# Altium schematic sheet POWER_PMIC.SchDoc
size A3; SheetNumber: 11; SheetTotal: 20
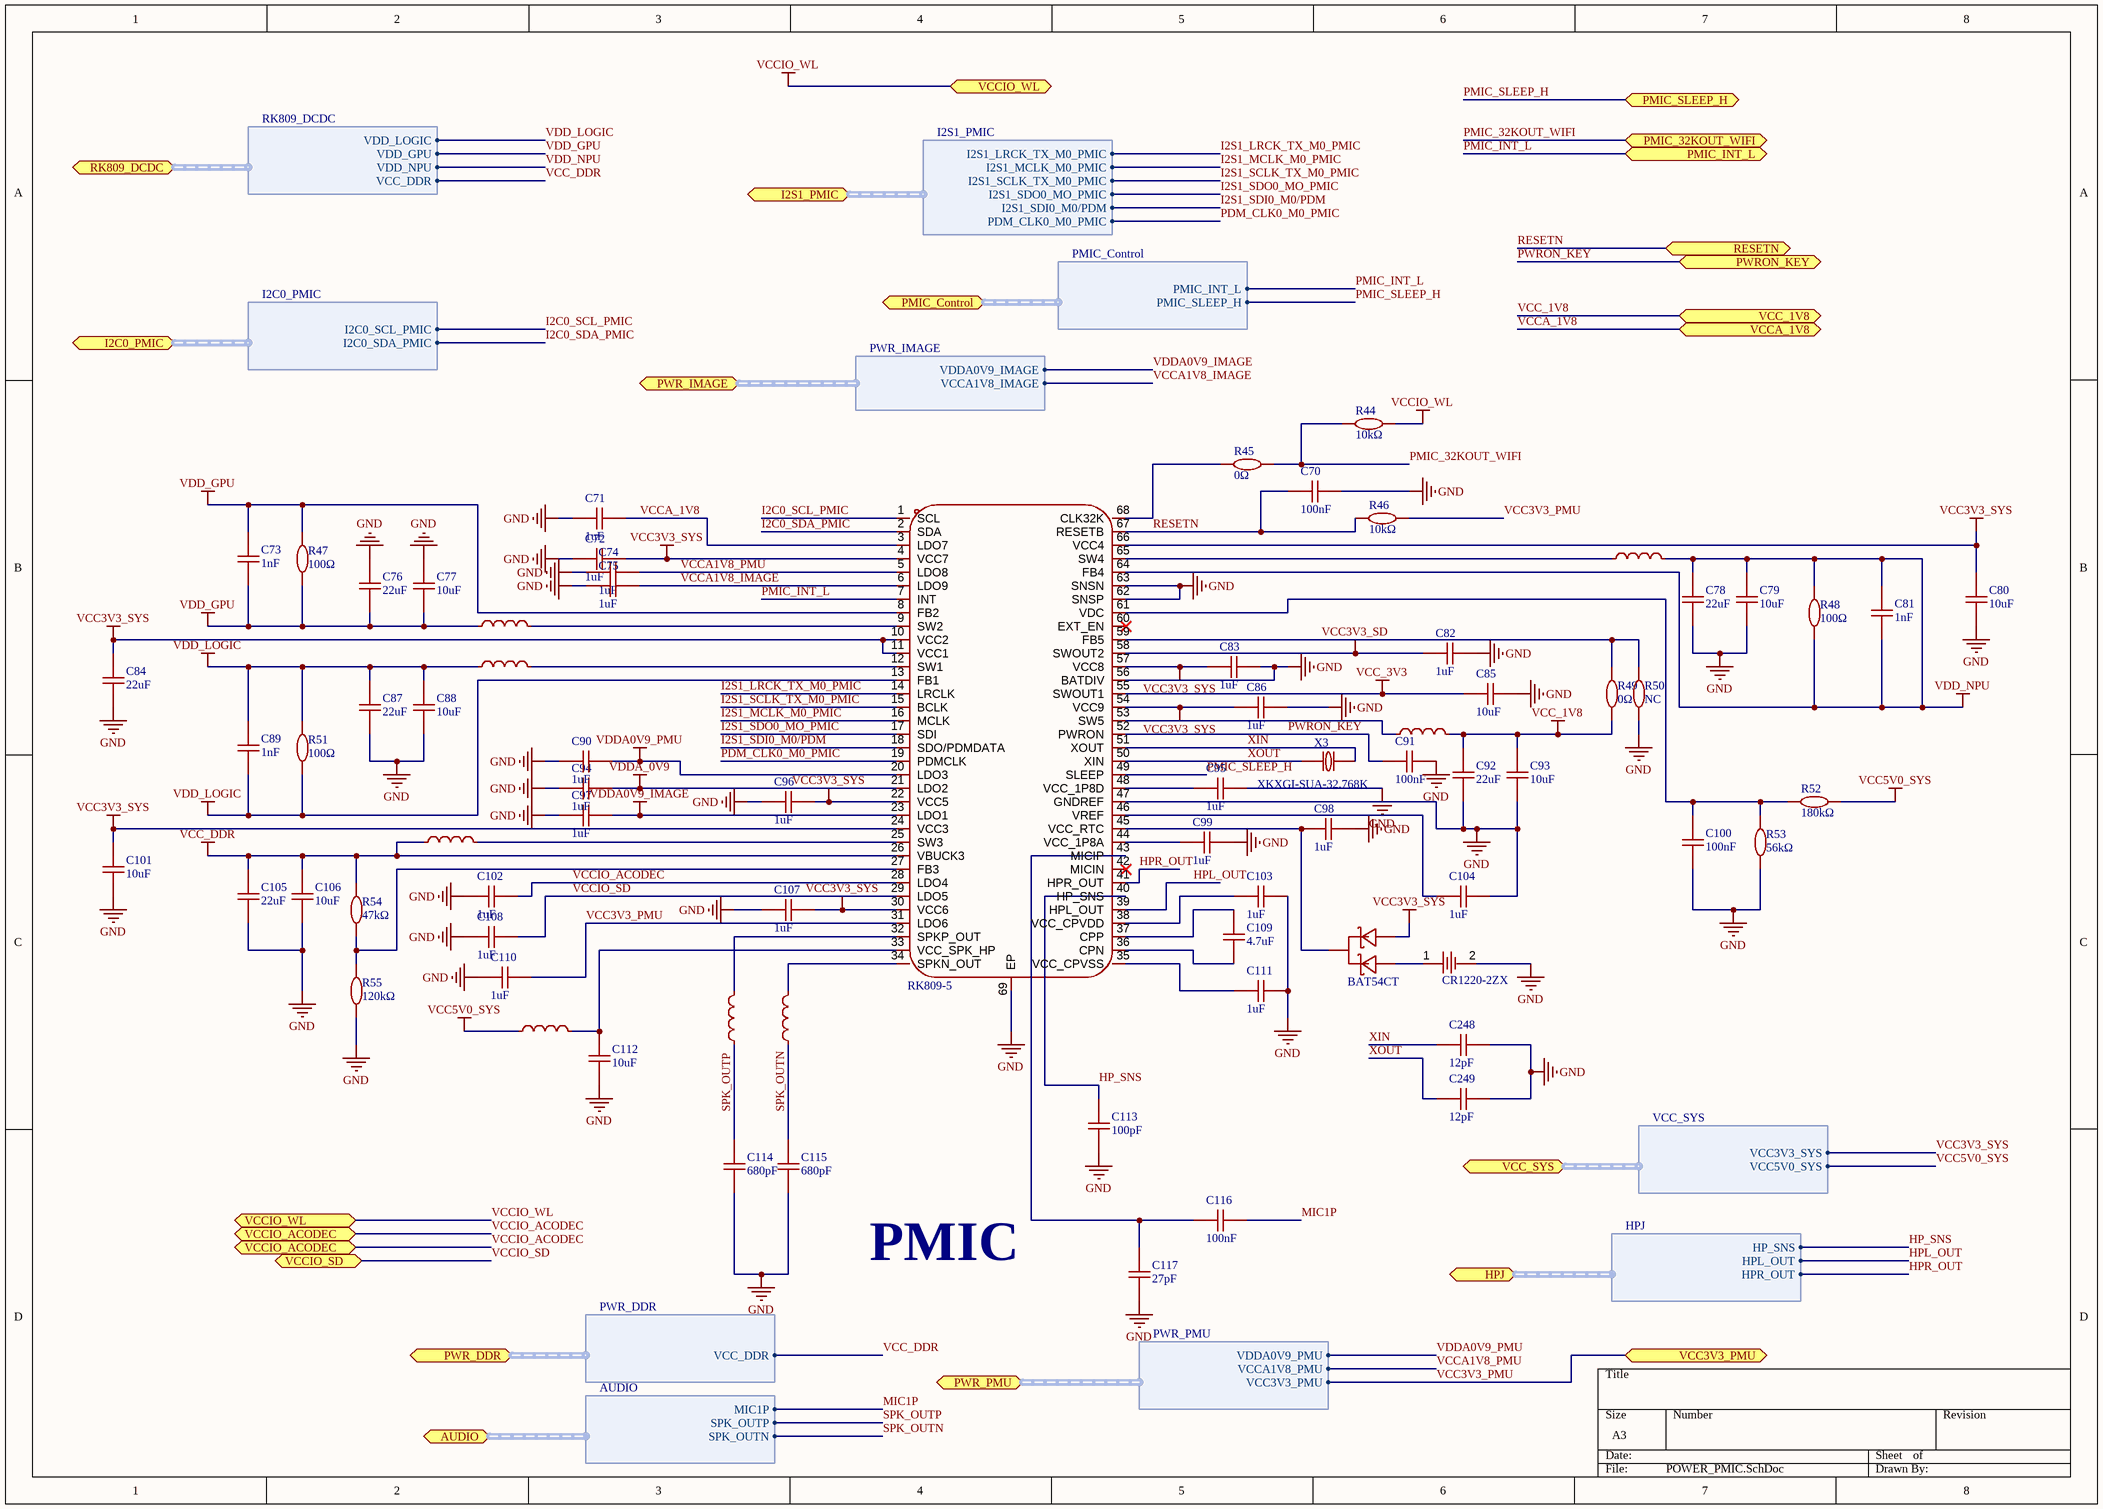
[diagram p0: POWER_PMIC.SchDoc]

## Parts
BT1  CR1220-2ZX  [BAT-SMD_CR1220-2ZX]
C70  100nF  [C0402]
C71  1uF  [C0402]
C72  1uF  [C0402]
C73  1nF  [C0402]
C74  1uF  [C0402]
C75  1uF  [C0402]
C76  22uF  [C0603]
C77  10uF  [C0603]
C78  22uF  [C0603]
C79  10uF  [C0603]
C80  10uF  [C0603]
C81  1nF  [C0402]
C82  1uF  [C0402]
C83  1uF  [C0402]
C84  22uF  [C0603]
C85  10uF  [C0603]
C86  1uF  [C0402]
C87  22uF  [C0603]
C88  10uF  [C0603]
C89  1nF  [C0402]
C90  1uF  [C0402]
C91  100nF  [C0402]
C92  22uF  [C0603]
C93  10uF  [C0603]
C94  1uF  [C0402]
C95  1uF  [C0402]
C96  1uF  [C0402]
C97  1uF  [C0402]
C98  1uF  [C0402]
C99  1uF  [C0402]
C100  100nF  [C0402]
C101  10uF  [C0603]
C102  1uF  [C0402]
C103  1uF  [C0402]
C104  1uF  [C0402]
C105  22uF  [C0603]
C106  10uF  [C0603]
C107  1uF  [C0402]
C108  1uF  [C0402]
C109  4.7uF  [C0402]
C110  1uF  [C0402]
C111  1uF  [C0402]
C112  10uF  [C0603]
C113  100pF  [C0402]
C114  680pF  [C0402]
C115  680pF  [C0402]
C116  100nF  [C0402]
C117  27pF  [C0402]
C248  12pF  [C0402]
C249  12pF  [C0402]
D9  BAT54CT  [SOT-523-3_L1.6-W0.8-P1.00-LS1.6-BR]
L3  470nH  [IND-SMD_L2.0-W1.6_MHCHL201610A-1R0M-Q8A]  (value not drawn)
L4  470nH  [IND-SMD_L2.0-W1.6_MHCHL201610A-1R0M-Q8A]  (value not drawn)
L5  470nH  [IND-SMD_L2.0-W1.6_MHCHL201610A-1R0M-Q8A]  (value not drawn)
L6  470nH  [IND-SMD_L2.0-W1.6_MHCHL201610A-1R0M-Q8A]  (value not drawn)
L7  470nH  [IND-SMD_L2.0-W1.6_MHCHL201610A-1R0M-Q8A]  (value not drawn)
L8  180Ω  [L0603]  (value not drawn)
L9  180Ω  [L0603]  (value not drawn)
L10  180Ω  [L0603]  (value not drawn)
R44  10kΩ  [R0402]
R45  0Ω  [R0402]
R46  10kΩ  [R0402]
R47  100Ω  [R0402]
R48  100Ω  [R0402]
R49  0Ω  [R0402]
R50  NC  [R0402]
R51  100Ω  [R0402]
R52  180kΩ  [R0402]
R53  56kΩ  [R0402]
R54  47kΩ  [R0402]
R55  120kΩ  [R0402]
U20  RK809-5  [QFN-68_L7.0-W7.0-P0.35-BL-EP5.5]
X3  XKXGI-SUA-32.768K  [CRYSTAL-SMD_L3.2-W1.5-1]

## Ports
AUDIO (bidir, harness AUDIO, see POWER[3D], Audio_AND_HPJ[1A], POWER[3D]), HPJ (bidir, harness HPJ, see POWER[3D], Audio_AND_HPJ[3C], POWER[3D]), I2C0_PMIC (bidir, harness I2C0_PMIC, see POWER[4C], POWER[4D], POWER_EXTENSION[4A], RK3566[3D], RK3566_OSC_PLL_PMUO1_2[5A]), I2S1_PMIC (bidir, harness I2S1_PMIC, see POWER[2D], RK3566[3B], RK3566_FLASH_SD_SARADC[6C]), PMIC_32KOUT_WIFI (bidir, see POWER[3D], Wi-Fi_BT[6C]), PMIC_Control (bidir, harness PMIC_Control, see POWER[3D], RK3566[3D], RK3566_OSC_PLL_PMUO1_2[1A]), PMIC_INT_L (bidir, see POWER[3D], RK3566[3D], RK3566_OSC_PLL_PMUO1_2[2B]), PMIC_SLEEP_H (bidir, see POWER[4C], POWER[4D], POWER_EXTENSION[1A], RK3566[3D], RK3566_OSC_PLL_PMUO1_2[2B]), PWR_DDR (bidir, harness PWR_DDR, see POWER[3D], POWER_FLASH_POWER_MANAGE[3B], RK3566[2A], RK3566_DDR_PHY[1A]), PWR_IMAGE (bidir, harness PWR_IMAGE, see POWER[2C], POWER[1C], RK3566[3C], RK3566_MIPI_HDMI[5D], RK3566_USB_GPIO[1B]), PWR_PMU (bidir, harness PWR_PMU, see POWER[2D], LPDDR4[4C], POWER[2D], RK3566[3C], RK3566_OSC_PLL_PMUO1_2[1A]), PWRON_KEY (bidir, see POWER[2C], DEBUG_AND_GPIO[8B], POWER[1C]), RESETN (bidir, see POWER[2C], DEBUG_AND_GPIO[8D], POWER[1C], RK3566[3C], RK3566_OSC_PLL_PMUO1_2[2B]), RK809_DCDC (bidir, harness RK809_DCDC, see POWER[3D], RK3566[3D], RK3566_POWER[2A]), VCC3V3_PMU (bidir, see POWER[3C], POWER_EXTENSION[1A], POWER_FLASH_POWER_MANAGE[3A]), VCC_1V8 (bidir, see POWER[3C], POWER_FLASH_POWER_MANAGE[3A]), VCC_SYS (bidir, harness VCC_SYS, see POWER[3C], Audio_AND_HPJ[3A], DEBUG_AND_GPIO[1D], HDMI[2C], MIPI_DSI_TP[6A], POWER[3B], POWER[6B], POWER_EXTENSION[4D], POWER_FLASH_POWER_MANAGE[3C], Wi-Fi_BT[3D]), VCCA_1V8 (bidir, see POWER[2C], DEBUG_AND_GPIO[5C], POWER[1C], RK3566[3C], RK3566_USB_GPIO[6C]), VCCIO_ACODEC (bidir, see POWER[3D], RK3566[3B], RK3566_FLASH_SD_SARADC[7C]), VCCIO_SD (bidir, see POWER[3D], RK3566[3B], RK3566_FLASH_SD_SARADC[7C]), VCCIO_WL (bidir, see POWER[4C], POWER[4D], POWER_EXTENSION[1A], RK3566[3B], RK3566_FLASH_SD_SARADC[7C])

## Harnesses
RK809_DCDC: VDD_LOGIC, VDD_GPU, VDD_NPU, VCC_DDR
I2C0_PMIC: I2C0_SCL_PMIC, I2C0_SDA_PMIC
I2S1_PMIC: I2S1_MCLK_M0_PMIC, I2S1_SCLK_TX_M0_PMIC, I2S1_SDO0_MO_PMIC, I2S1_SDI0_M0/PDM, I2S1_LRCK_TX_M0_PMIC, PDM_CLK0_M0_PMIC
PMIC_Control: PMIC_INT_L, PMIC_SLEEP_H
AUDIO: SPK_OUTP, SPK_OUTN, MIC1P
HPJ: HPL_OUT, HPR_OUT, HP_SNS
PWR_DDR: VCC_DDR
PWR_IMAGE: VDDA0V9_IMAGE, VCCA1V8_IMAGE
PWR_PMU: VCCA1V8_PMU, VDDA0V9_PMU, VCC3V3_PMU
VCC_SYS: VCC3V3_SYS, VCC5V0_SYS

## Nets
GND: BT1.2 C70.2 C71.2 C72.2 C74.2 C75.2 C76.2 C77.2 C78.1 C79.1 C80.1 C82.1 C83.2 C84.1 C85.1 C86.2 C87.1 C88.1 C90.2 C91.2 C92.1 C93.1 C94.2 C95.2 C96.2 C97.2 C98.1 C99.2 C100.1 C101.1 C102.2 C103.1 C104.1 C105.1 C106.1 C107.2 C108.2 C110.2 C111.2 C112.1 C113.1 C114.1 C115.1 C117.1 C248.2 C249.2 R50.2 R53.1 R55.1 U20.47(GNDREF) U20.56(BATDIV) U20.62(SNSP) U20.63(SNSN) U20.69(EP)
VCC3V3_SD: C82.2 U20.58(SWOUT2)
VCC3V3_SYS: C72.1 C80.2 C83.1 C84.2 C86.1 C96.1 C101.2 C107.1 D9.2(A) U20.4(VCC7) U20.10(VCC2) U20.11(VCC1) U20.22(VCC5) U20.24(VCC3) U20.30(VCC6) U20.54(VCC9) U20.57(VCC8) U20.66(VCC4) ; port VCC_SYS.VCC3V3_SYS
VCC5V0_SYS: L10.1 R52.2 ; port VCC_SYS.VCC5V0_SYS
VCC_1V8: C92.2 C93.2 L6.2 R49.1 ; port VCC_1V8
VCC_3V3: C85.2 U20.55(SWOUT1)
VCC_DDR: C105.2 C106.2 L7.1 R54.2 U20.26(VBUCK3) ; port RK809_DCDC.VCC_DDR, port PWR_DDR.VCC_DDR
VCCIO_WL: R44.2 ; port VCCIO_WL
VDD_GPU: C73.1 C73.2 C76.1 C77.1 L4.1 R47.1 R47.2 U20.8(FB2) ; port RK809_DCDC.VDD_GPU
VDD_LOGIC: C87.2 C88.2 C89.1 C89.2 L5.1 R51.1 R51.2 U20.13(FB1) ; port RK809_DCDC.VDD_LOGIC
VDD_NPU: C78.2 C79.2 C81.1 C81.2 L3.2 R48.1 R48.2 U20.64(FB4) ; port RK809_DCDC.VDD_NPU
VDDA0V9_IMAGE: C97.1 U20.23(LDO1) ; port PWR_IMAGE.VDDA0V9_IMAGE
VDDA0V9_PMU: C90.1 U20.20(LDO3) ; port PWR_PMU.VDDA0V9_PMU
VDDA_0V9: C94.1 U20.21(LDO2)
HP_SNS: C113.2 U20.40(HP_SNS) ; port HPJ.HP_SNS
HPL_OUT: U20.39(HPL_OUT) ; port HPJ.HPL_OUT
HPR_OUT: U20.41(HPR_OUT) ; port HPJ.HPR_OUT
I2C0_SCL_PMIC: U20.1(SCL) ; port I2C0_PMIC.I2C0_SCL_PMIC
I2C0_SDA_PMIC: U20.2(SDA) ; port I2C0_PMIC.I2C0_SDA_PMIC
I2S1_LRCK_TX_M0_PMIC: U20.14(LRCLK) ; port I2S1_PMIC.I2S1_LRCK_TX_M0_PMIC
I2S1_MCLK_M0_PMIC: U20.16(MCLK) ; port I2S1_PMIC.I2S1_MCLK_M0_PMIC
I2S1_SCLK_TX_M0_PMIC: U20.15(BCLK) ; port I2S1_PMIC.I2S1_SCLK_TX_M0_PMIC
I2S1_SDI0_M0/PDM: U20.18(SDO/PDMDATA) ; port I2S1_PMIC.I2S1_SDI0_M0/PDM
I2S1_SDO0_MO_PMIC: U20.17(SDI) ; port I2S1_PMIC.I2S1_SDO0_MO_PMIC
MIC1P: C116.2 ; port AUDIO.MIC1P
PDM_CLK0_M0_PMIC: U20.19(PDMCLK) ; port I2S1_PMIC.PDM_CLK0_M0_PMIC
PMIC_32KOUT_WIFI: R44.1 R45.2 ; port PMIC_32KOUT_WIFI
PMIC_INT_L: U20.7(INT) ; port PMIC_INT_L, port PMIC_Control.PMIC_INT_L
PMIC_SLEEP_H: U20.49(SLEEP) ; port PMIC_SLEEP_H, port PMIC_Control.PMIC_SLEEP_H
PWRON_KEY: C91.1 U20.52(PWRON) ; port PWRON_KEY
RESETN: C70.1 R46.1 U20.67(RESETB) ; port RESETN
SPK_OUTN: C115.2 L9.1 ; port AUDIO.SPK_OUTN
SPK_OUTP: C114.2 L8.1 ; port AUDIO.SPK_OUTP
VCC3V3_PMU: C110.1 R46.2 U20.31(LDO6) ; port VCC3V3_PMU, port PWR_PMU.VCC3V3_PMU
VCCA1V8_IMAGE: C75.1 U20.6(LDO9) ; port PWR_IMAGE.VCCA1V8_IMAGE
VCCA1V8_PMU: C74.1 U20.5(LDO8) ; port PWR_PMU.VCCA1V8_PMU
VCCA_1V8: C71.1 U20.3(LDO7) ; port VCCA_1V8
VCCIO_ACODEC: C102.1 U20.28(LDO4) ; port VCCIO_ACODEC
VCCIO_SD: C108.1 U20.29(LDO5) ; port VCCIO_SD
XIN: C248.1 U20.51(XOUT) X3.2
XOUT: C249.1 U20.50(XIN) X3.1
NetBT1_1: BT1.1 D9.1(A)
NetC95_1: C95.1 U20.48(VCC_1P8D)
NetC98_2: C98.2 D9.3(K) U20.45(VCC_RTC)
NetC99_1: C99.1 U20.44(VCC_1P8A)
NetC100_2: C100.2 R52.1 R53.2 U20.61(VDC)
NetC103_2: C103.2 U20.38(VCC_CPVDD)
NetC104_2: C104.2 U20.46(VREF)
NetC109_1: C109.1 U20.36(CPN)
NetC109_2: C109.2 U20.37(CPP)
NetC111_1: C111.1 U20.35(VCC_CPVSS)
NetC112_2: C112.2 L10.2 U20.33(VCC_SPK_HP)
NetC116_1: C116.1 C117.2 U20.43(MICIP)
NetL3_1: L3.1 U20.65(SW4)
NetL4_2: L4.2 U20.9(SW2)
NetL5_2: L5.2 U20.12(SW1)
NetL6_1: L6.1 U20.53(SW5)
NetL7_2: L7.2 U20.25(SW3)
NetL8_2: L8.2 U20.32(SPKP_OUT)
NetL9_2: L9.2 U20.34(SPKN_OUT)
NetR45_1: R45.1 U20.68(CLK32K)
NetR49_2: R49.2 R50.1 U20.59(FB5)
NetR54_1: R54.1 R55.2 U20.27(FB3)

Not connected (* = marked no-connect by the designer): U20 42(MICIN)* 60(EXT_EN)*

## Notes on the sheet
- PMIC

## Library data of the parts
BT1 = CR1220-2ZX: Battery; Symbol: CR1220-2ZX
C70 C91 C100 C116 = 100nF: 50V 100nF X7R ±10% 0402 Ceramic Capacitors ROHS
C71 C72 C74 C75 C82 C83 C86 C90 C94-C99 C102-C104 C107 C108 C110 C111 = 1uF: 50V 1uF X5R ±10% 0402 Ceramic Capacitors ROHS
C73 C81 C89 = 1nF: 50V 1nF X7R ±10% 0402 Ceramic Capacitors ROHS
C76 C78 C84 C87 C92 C105 = 22uF: 16V 22uF X5R ±20% 0603 Ceramic Capacitors ROHS
C77 C79 C80 C85 C88 C93 C101 C106 C112 = 10uF: 10V 10uF X5R ±10% 0603 Ceramic Capacitors ROHS
C109 = 4.7uF: 10V 4.7uF X5R ±20% 0402 Ceramic Capacitors ROHS
C113 = 100pF: 50V 100pF C0G ±5% 0402 Ceramic Capacitors ROHS
C114 C115 = 680pF: 50V 680pF C0G ±5% 0402 Ceramic Capacitors ROHS
C117 = 27pF: 50V 27pF C0G ±5% 0402 Ceramic Capacitors ROHS
C248 C249 = 12pF: 50V 12pF C0G ±5% 0402 Ceramic Capacitors ROHS
D9 = BAT54CT: 电压:30V 电流:200mA 特性：低正向压降。 快速开关。 PN结保护环，用于瞬态和ESD保护; Symbol: BAT54CT
L3-L7 = MCS20FC-R47MHC: 0806 MCS20FC-R47MHC; Manufacturer: Sunltech(顺磁); Symbol: SLW4030S1R0NST; Add into BOM: yes; Value: 1uH; Tolerance: ±30%; Current Rating: 4.15A; DC Resistance(DCR): 18mΩ; Device: SLW4030S1R0NST; LCSC Part Name: 1uH ±30%; Supplier Part: C206354; Manufacturer Part: SLW4030S1R0NST; Supplier Footprint: SMD,4x4mm; JLCPCB Part Class: Extended Part; Datasheet: https://item.szlcsc.com/datasheet/SLW4030S1R0NST/207399.html; Supplier: LCSC; Convert to PCB: yes
L8-L10 = BLM18PG181SN1D: 单路 0603磁珠 阻抗180Ω@100MHz; Manufacturer: cjiang(长江微电); Symbol: FNR6020S4R7MT; Add into BOM: yes; Value: 4.7uH; Tolerance: ±20%; Saturation Current (Isat): 3.6A; DC Resistance (DCR): 75mΩ; Device: FNR6020S4R7MT; LCSC Part Name: 4.7uH ±20% 3.6A; Supplier Part: C168008; Manufacturer Part: FNR6020S4R7MT; Supplier Footprint: SMD,6x6mm; JLCPCB Part Class: Extended Part; Datasheet: https://atta.szlcsc.com/upload/public/pdf/source/20190327/C167925_9EFF0AABC4CA629C2CC95961DBF7D39D.pdf; Supplier: LCSC; Convert to PCB: yes
R44 R46 = 10kΩ: 62.5mW 10kΩ 50V ±100ppm/℃ Thick Film Resistor ±1% 0402 Chip Resistor - Surface Mount ROHS
R45 R49 R50 = 0Ω: 0Ω 62.5mW 50V Thick Film Resistor ±1% 0402 Chip Resistor - Surface Mount ROHS
R47 R48 R51 = 100Ω: 100Ω 62.5mW 50V ±100ppm/℃ Thick Film Resistor ±1% 0402 Chip Resistor - Surface Mount ROHS
R52 = 180kΩ: 62.5mW 180kΩ 50V ±100ppm/℃ Thick Film Resistor ±1% 0402 Chip Resistor - Surface Mount ROHS
R53 = 56kΩ: 56kΩ 62.5mW 50V ±100ppm/℃ Thick Film Resistor ±1% 0402 Chip Resistor - Surface Mount ROHS
R54 = 47kΩ: 62.5mW 47kΩ 50V ±100ppm/℃ Thick Film Resistor ±1% 0402 Chip Resistor - Surface Mount ROHS
R55 = 120kΩ: 62.5mW 120kΩ 50V ±100ppm/℃ Thick Film Resistor ±1% 0402 Chip Resistor - Surface Mount ROHS
X3 = XKXGI-SUA-32.768K: SMD3215-2P XKXGI-SUA-32.768K
U20 = RK809-5: Symbol: RK809-5